# EAGLE schematic main (EAGLE 9.5.1)
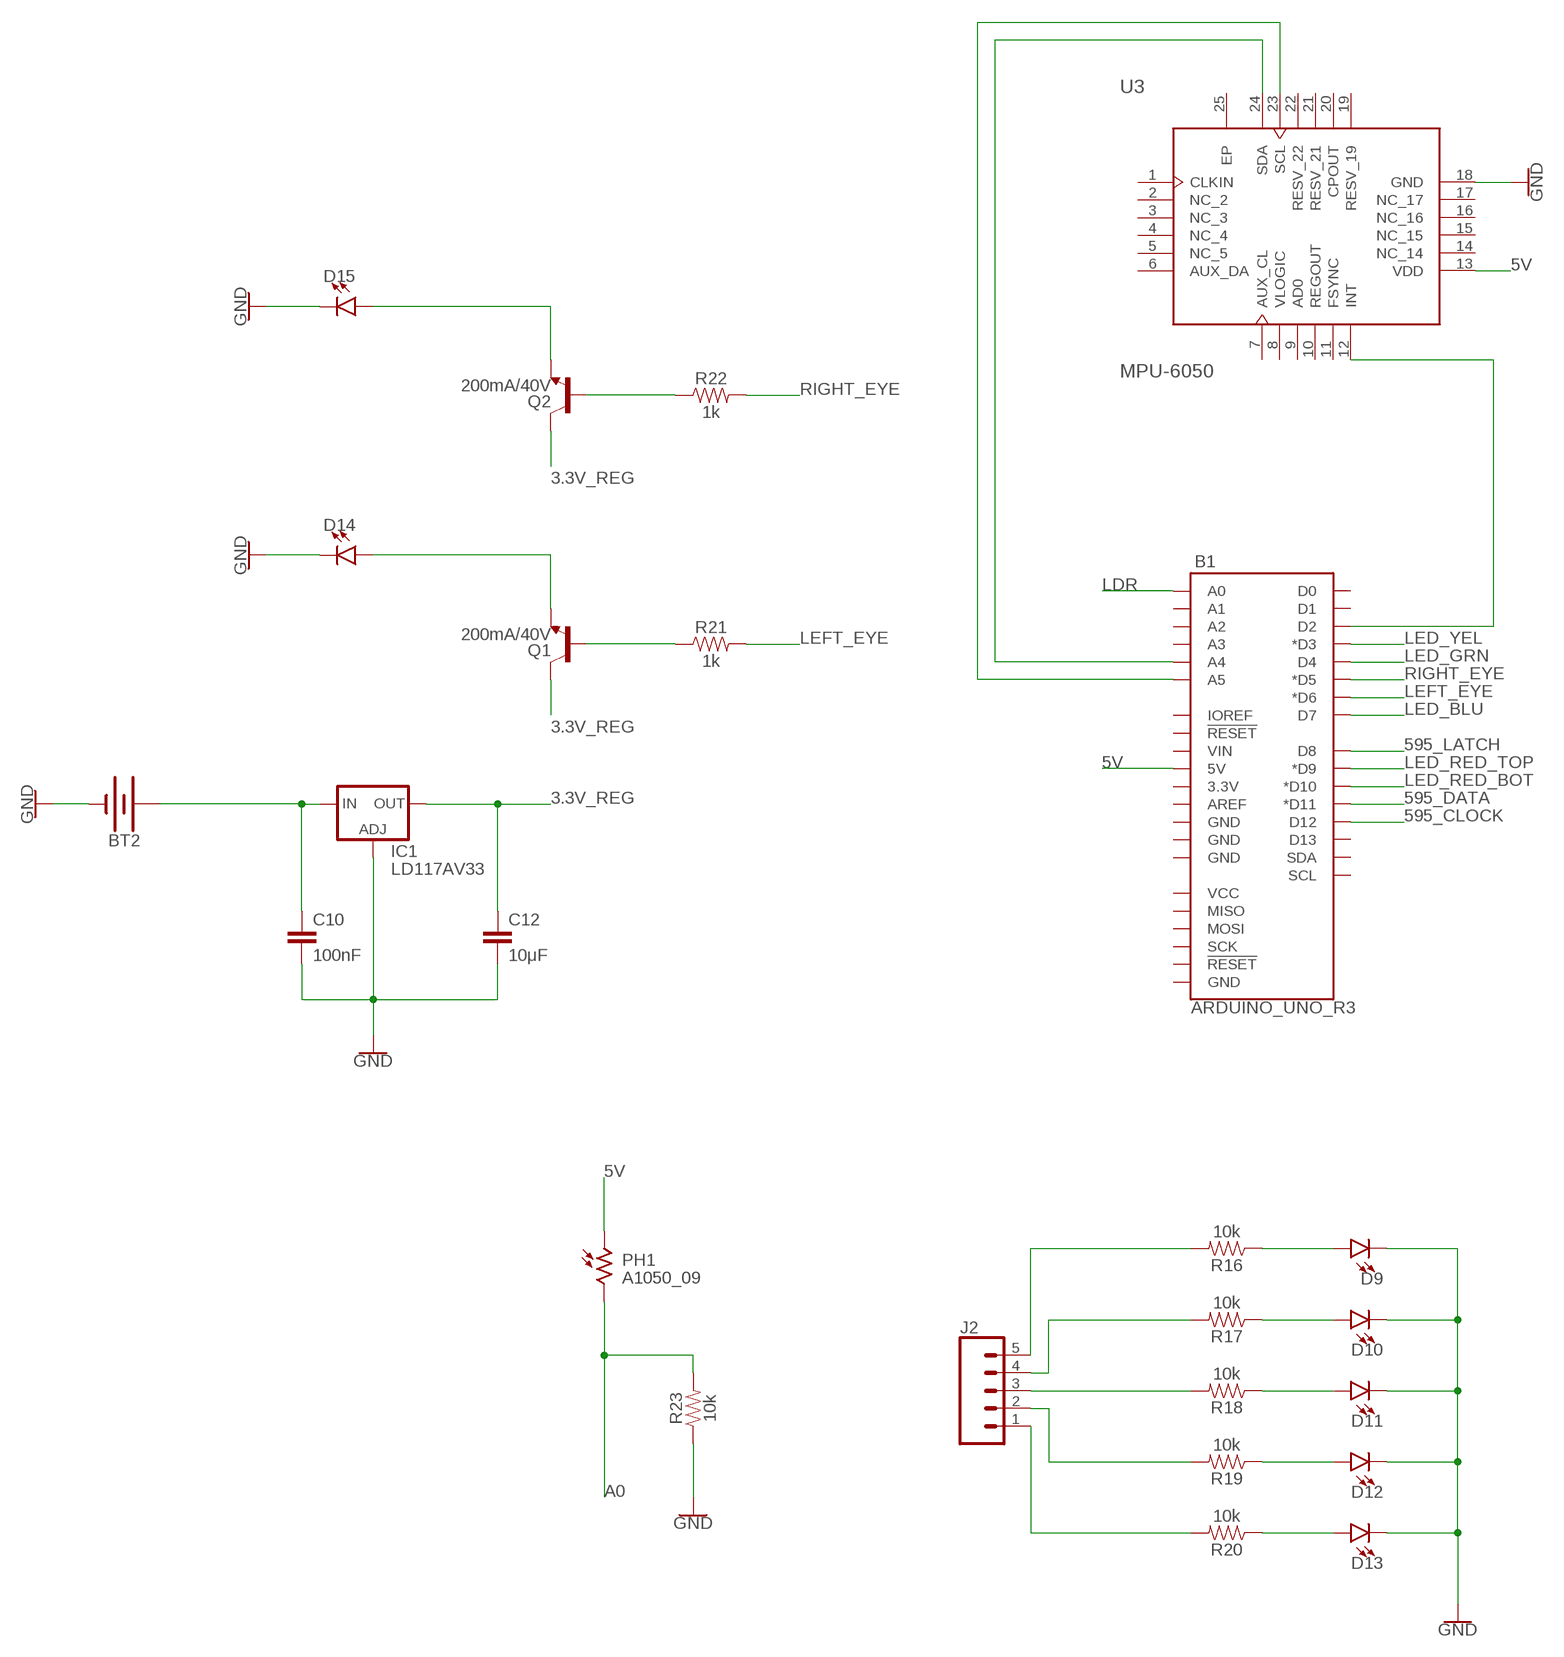
[diagram p0: schematic, sheet 1, part 1 of 2]
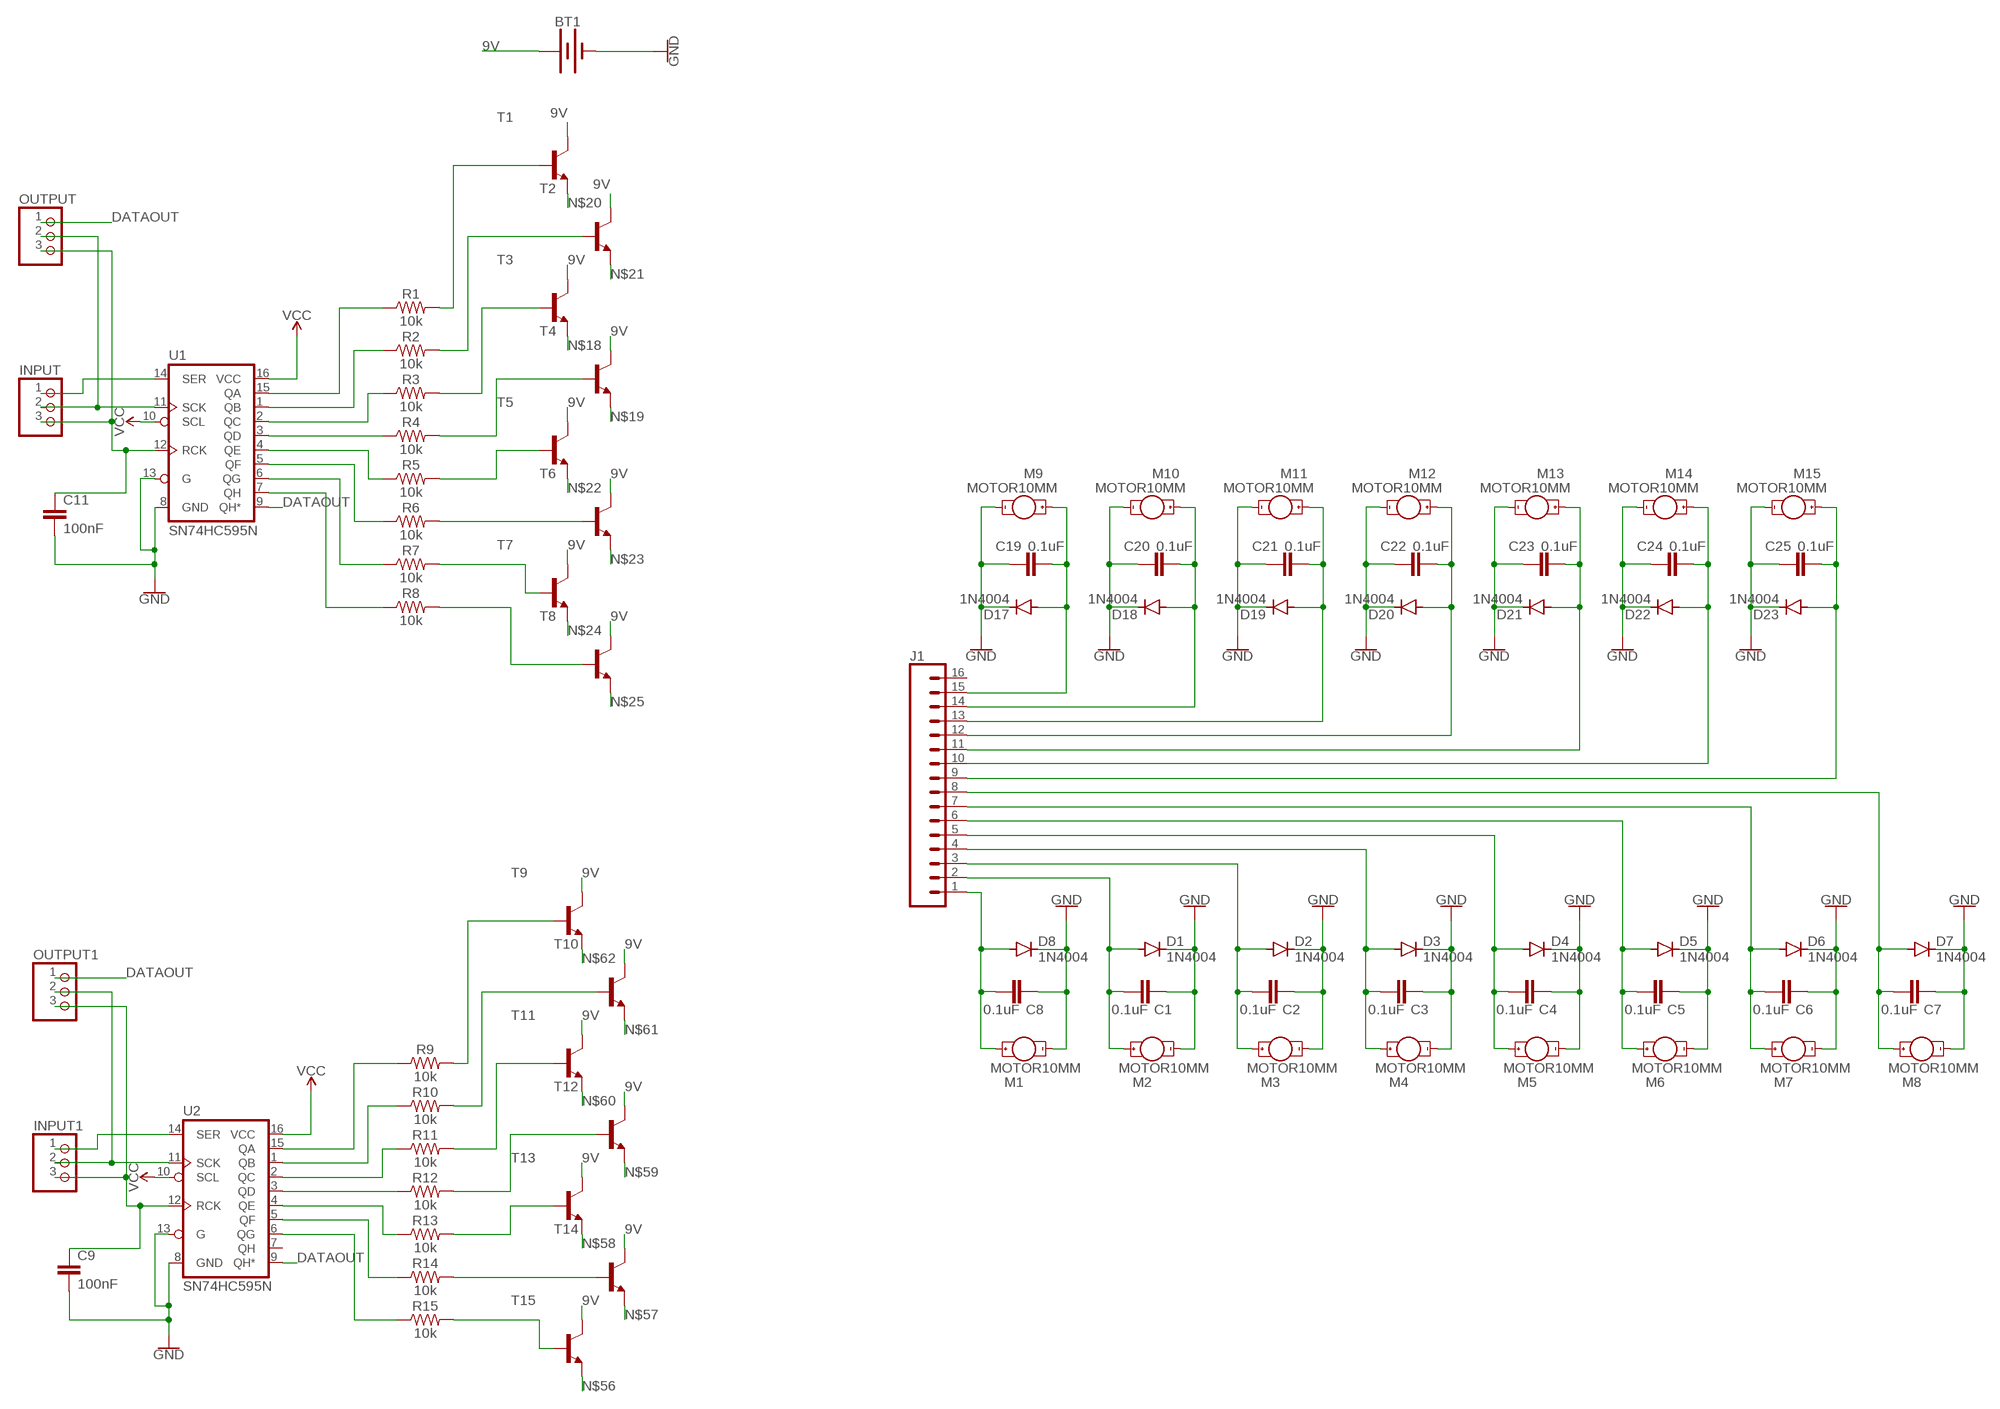
[diagram p1: schematic, sheet 1, part 2 of 2]

## Parts
B1  ARDUINO_UNO_R3  [ARDUINO_R3]
BT1  BATTERY-9V  [BATTCON_9V]
BT2  BATTERY-9V  [BATTCON_9V]
C1  0.1uF  0.1UF-KIT-EZ-50V-20%  [CAP-PTH-SMALL-KIT]
C2  0.1uF  0.1UF-KIT-EZ-50V-20%  [CAP-PTH-SMALL-KIT]
C3  0.1uF  0.1UF-KIT-EZ-50V-20%  [CAP-PTH-SMALL-KIT]
C4  0.1uF  0.1UF-KIT-EZ-50V-20%  [CAP-PTH-SMALL-KIT]
C5  0.1uF  0.1UF-KIT-EZ-50V-20%  [CAP-PTH-SMALL-KIT]
C6  0.1uF  0.1UF-KIT-EZ-50V-20%  [CAP-PTH-SMALL-KIT]
C7  0.1uF  0.1UF-KIT-EZ-50V-20%  [CAP-PTH-SMALL-KIT]
C8  0.1uF  0.1UF-KIT-EZ-50V-20%  [CAP-PTH-SMALL-KIT]
C9  100nF  10NF-PTH-10MM-10000V-1-%  [CAP-PTH-10MM]
C10  100nF  10NF-PTH-10MM-10000V-1-%  [CAP-PTH-10MM]
C11  100nF  10NF-PTH-10MM-10000V-1-%  [CAP-PTH-10MM]
C12  10μF  10NF-PTH-10MM-10000V-1-%  [CAP-PTH-10MM]
C19  0.1uF  0.1UF-KIT-EZ-50V-20%  [CAP-PTH-SMALL-KIT]
C20  0.1uF  0.1UF-KIT-EZ-50V-20%  [CAP-PTH-SMALL-KIT]
C21  0.1uF  0.1UF-KIT-EZ-50V-20%  [CAP-PTH-SMALL-KIT]
C22  0.1uF  0.1UF-KIT-EZ-50V-20%  [CAP-PTH-SMALL-KIT]
C23  0.1uF  0.1UF-KIT-EZ-50V-20%  [CAP-PTH-SMALL-KIT]
C24  0.1uF  0.1UF-KIT-EZ-50V-20%  [CAP-PTH-SMALL-KIT]
C25  0.1uF  0.1UF-KIT-EZ-50V-20%  [CAP-PTH-SMALL-KIT]
D1  1N4004  [DO41-10]
D2  1N4004  [DO41-10]
D3  1N4004  [DO41-10]
D4  1N4004  [DO41-10]
D5  1N4004  [DO41-10]
D6  1N4004  [DO41-10]
D7  1N4004  [DO41-10]
D8  1N4004  [DO41-10]
D9  LED5MM  [LED_5MM]
D10  LED5MM  [LED_5MM]
D11  LED5MM  [LED_5MM]
D12  LED5MM  [LED_5MM]
D13  LED5MM  [LED_5MM]
D14  LED10MM  [LED_10MM]
D15  LED10MM  [LED_10MM]
D17  1N4004  [DO41-10]
D18  1N4004  [DO41-10]
D19  1N4004  [DO41-10]
D20  1N4004  [DO41-10]
D21  1N4004  [DO41-10]
D22  1N4004  [DO41-10]
D23  1N4004  [DO41-10]
IC1  LD117AV33  [TO220L1]
INPUT  PINHD-1X3  [1X03]
INPUT1  PINHD-1X3  [1X03]
J1  CONN_16  [1X16]
J2  CONN_05  [1X05]
M1  MOTOR10MM  [VIBE-MOTOR-10MM]
M2  MOTOR10MM  [VIBE-MOTOR-10MM]
M3  MOTOR10MM  [VIBE-MOTOR-10MM]
M4  MOTOR10MM  [VIBE-MOTOR-10MM]
M5  MOTOR10MM  [VIBE-MOTOR-10MM]
M6  MOTOR10MM  [VIBE-MOTOR-10MM]
M7  MOTOR10MM  [VIBE-MOTOR-10MM]
M8  MOTOR10MM  [VIBE-MOTOR-10MM]
M9  MOTOR10MM  [VIBE-MOTOR-10MM]
M10  MOTOR10MM  [VIBE-MOTOR-10MM]
M11  MOTOR10MM  [VIBE-MOTOR-10MM]
M12  MOTOR10MM  [VIBE-MOTOR-10MM]
M13  MOTOR10MM  [VIBE-MOTOR-10MM]
M14  MOTOR10MM  [VIBE-MOTOR-10MM]
M15  MOTOR10MM  [VIBE-MOTOR-10MM]
OUTPUT  PINHD-1X3  [1X03]
OUTPUT1  PINHD-1X3  [1X03]
PH1  A1050_09  [T0-46-A10XX]
Q1  200mA/40V  TRANS_NPN-2N3904  [TO-92]
Q2  200mA/40V  TRANS_NPN-2N3904  [TO-92]
R1  10k  10KOHM-HORIZ-1/4W-1%  [AXIAL-0.3]
R2  10k  10KOHM-HORIZ-1/4W-1%  [AXIAL-0.3]
R3  10k  10KOHM-HORIZ-1/4W-1%  [AXIAL-0.3]
R4  10k  10KOHM-HORIZ-1/4W-1%  [AXIAL-0.3]
R5  10k  10KOHM-HORIZ-1/4W-1%  [AXIAL-0.3]
R6  10k  10KOHM-HORIZ-1/4W-1%  [AXIAL-0.3]
R7  10k  10KOHM-HORIZ-1/4W-1%  [AXIAL-0.3]
R8  10k  10KOHM-HORIZ-1/4W-1%  [AXIAL-0.3]
R9  10k  10KOHM-HORIZ-1/4W-1%  [AXIAL-0.3]
R10  10k  10KOHM-HORIZ-1/4W-1%  [AXIAL-0.3]
R11  10k  10KOHM-HORIZ-1/4W-1%  [AXIAL-0.3]
R12  10k  10KOHM-HORIZ-1/4W-1%  [AXIAL-0.3]
R13  10k  10KOHM-HORIZ-1/4W-1%  [AXIAL-0.3]
R14  10k  10KOHM-HORIZ-1/4W-1%  [AXIAL-0.3]
R15  10k  10KOHM-HORIZ-1/4W-1%  [AXIAL-0.3]
R16  10k  10KOHM-HORIZ-1/4W-1%  [AXIAL-0.3]
R17  10k  10KOHM-HORIZ-1/4W-1%  [AXIAL-0.3]
R18  10k  10KOHM-HORIZ-1/4W-1%  [AXIAL-0.3]
R19  10k  10KOHM-HORIZ-1/4W-1%  [AXIAL-0.3]
R20  10k  10KOHM-HORIZ-1/4W-1%  [AXIAL-0.3]
R21  1k  1KOHM-HORIZ-1/4W-1%  [AXIAL-0.3]
R22  1k  1KOHM-HORIZ-1/4W-1%  [AXIAL-0.3]
R23  10k  10KOHM-HORIZ-1/4W-1%  [AXIAL-0.3]
T1  2N3904-NPN-TO92-EBC  [TO92-EBC]
T2  2N3904-NPN-TO92-EBC  [TO92-EBC]
T3  2N3904-NPN-TO92-EBC  [TO92-EBC]
T4  2N3904-NPN-TO92-EBC  [TO92-EBC]
T5  2N3904-NPN-TO92-EBC  [TO92-EBC]
T6  2N3904-NPN-TO92-EBC  [TO92-EBC]
T7  2N3904-NPN-TO92-EBC  [TO92-EBC]
T8  2N3904-NPN-TO92-EBC  [TO92-EBC]
T9  2N3904-NPN-TO92-EBC  [TO92-EBC]
T10  2N3904-NPN-TO92-EBC  [TO92-EBC]
T11  2N3904-NPN-TO92-EBC  [TO92-EBC]
T12  2N3904-NPN-TO92-EBC  [TO92-EBC]
T13  2N3904-NPN-TO92-EBC  [TO92-EBC]
T14  2N3904-NPN-TO92-EBC  [TO92-EBC]
T15  2N3904-NPN-TO92-EBC  [TO92-EBC]
U1  SN74HC595N  74HC595N  [DIP16]
U2  SN74HC595N  74HC595N  [DIP16]
U3  MPU-6050  [24-VFQFN]

## Nets
3.3V_REG: C12.1 IC1.2(OUT) Q1.3(C) Q2.3(C)
5V: B1.5V PH1.1 U3.13(VDD)
9V: BT1.+ T1.C T2.C T3.C T4.C T5.C T6.C T7.C T8.C T9.C T10.C T11.C T12.C T13.C T14.C T15.C
595_CLOCK: B1.D12
595_DATA: B1.D11(*D11)
595_LATCH: B1.D8
A0: PH1.2 R23.P$2
DATAOUT: OUTPUT1.1 OUTPUT.1 U1.9(QH*) U2.9(QH*)
GND: BT1.- BT2.- C1.1 C2.1 C3.1 C4.1 C5.1 C6.1 C7.1 C8.1 C9.2 C10.2 C11.2 C12.2 C19.1 C20.1 C21.1 C22.1 C23.1 C24.1 C25.1 D1.C D2.C D3.C D4.C D5.C D6.C D7.C D8.C D9.K(C) D10.K(C) D11.K(C) D12.K(C) D13.K(C) D14.C D15.C D17.C D18.C D19.C D20.C D21.C D22.C D23.C IC1.1(ADJ) M1.- M2.- M3.- M4.- M5.- M6.- M7.- M8.- M9.- M10.- M11.- M12.- M13.- M14.- M15.- R23.P$1 U1.8(GND) U1.13(G) U2.8(GND) U2.13(G) U3.18(GND)
LDR: B1.A0
LED_BLU: B1.D7
LED_GRN: B1.D4
LED_RED_BOT: B1.D10(*D10)
LED_RED_TOP: B1.D9(*D9)
LED_YEL: B1.D3(*D3)
LEFT_EYE: B1.D6(*D6) R21.P$2
N$1: R12.P$1 U2.3(QD)
N$2: R4.P$1 U1.3(QD)
N$3: R5.P$1 U1.4(QE)
N$4: R6.P$1 U1.5(QF)
N$5: R7.P$1 U1.6(QG)
N$6: R8.P$1 U1.7(QH)
N$7: R3.P$1 U1.2(QC)
N$8: R2.P$1 U1.1(QB)
N$9: R1.P$1 U1.15(QA)
N$10: R1.P$2 T1.B
N$11: R2.P$2 T2.B
N$12: R3.P$2 T3.B
N$13: R4.P$2 T4.B
N$14: R5.P$2 T5.B
N$15: R6.P$2 T6.B
N$16: R7.P$2 T7.B
N$17: R8.P$2 T8.B
N$18: C2.2 D2.A J1.3 M3.+ T3.E
N$19: C3.2 D3.A J1.4 M4.+ T4.E
N$20: C8.2 D8.A J1.1 M1.+ T1.E
N$21: C1.2 D1.A J1.2 M2.+ T2.E
N$22: C4.2 D4.A J1.5 M5.+ T5.E
N$23: C5.2 D5.A J1.6 M6.+ T6.E
N$24: C6.2 D6.A J1.7 M7.+ T7.E
N$25: C7.2 D7.A J1.8 M8.+ T8.E
N$26: R13.P$1 U2.4(QE)
N$27: R14.P$1 U2.5(QF)
N$28: INPUT.1 U1.14(SER)
N$29: C11.1 INPUT.3 OUTPUT.3 U1.12(RCK)
N$30: INPUT.2 OUTPUT.2 U1.11(SCK)
N$31: R15.P$1 U2.6(QG)
N$32: J2.5 R16.P$2
N$33: R11.P$1 U2.2(QC)
N$34: R10.P$1 U2.1(QB)
N$35: R9.P$1 U2.15(QA)
N$36: R9.P$2 T9.B
N$37: R10.P$2 T10.B
N$38: R11.P$2 T11.B
N$39: R12.P$2 T12.B
N$40: R13.P$2 T13.B
N$41: R14.P$2 T14.B
N$42: R15.P$2 T15.B
N$43: D9.A R16.P$1
N$44: INPUT1.1 U2.14(SER)
N$45: C9.1 INPUT1.3 OUTPUT1.3 U2.12(RCK)
N$46: INPUT1.2 OUTPUT1.2 U2.11(SCK)
N$47: BT2.+ C10.1 IC1.3(IN)
N$48: J2.4 R17.P$2
N$49: D10.A R17.P$1
N$50: J2.3 R18.P$2
N$51: D11.A R18.P$1
N$52: J2.2 R19.P$2
N$53: J2.1 R20.P$2
N$54: D13.A R20.P$1
N$55: D12.A R19.P$1
N$56: C19.2 D17.A J1.15 M9.+ T15.E
N$57: C20.2 D18.A J1.14 M10.+ T14.E
N$58: C21.2 D19.A J1.13 M11.+ T13.E
N$59: C22.2 D20.A J1.12 M12.+ T12.E
N$60: C23.2 D21.A J1.11 M13.+ T11.E
N$61: C24.2 D22.A J1.10 M14.+ T10.E
N$62: C25.2 D23.A J1.9 M15.+ T9.E
N$63: Q1.2(B) R21.P$1
N$64: B1.D2 U3.12(INT)
N$65: D14.A Q1.1(E)
N$66: B1.A4 U3.24(SDA)
N$67: Q2.2(B) R22.P$1
N$68: B1.A5 U3.23(SCL)
N$69: D15.A Q2.1(E)
RIGHT_EYE: B1.D5(*D5) R22.P$2
VCC: U1.10(SCL) U1.16(VCC) U2.10(SCL) U2.16(VCC)
Unconnected: B1.3.3V B1.A1 B1.A2 B1.A3 B1.AREF B1.D0 B1.D1 B1.D13 B1.GND@1(GND) B1.GND@2(GND) B1.GND@3(GND) B1.GND@4(GND) B1.IOREF B1.MISO B1.MOSI B1.RESET@1(!RESET!) B1.RESET@2(!RESET!) B1.SCK B1.SCL B1.SDA B1.VCC B1.VIN J1.16 U2.7(QH) U3.1(CLKIN) U3.2(NC_2) U3.3(NC_3) U3.4(NC_4) U3.5(NC_5) U3.6(AUX_DA) U3.7(AUX_CL) U3.9(AD0) U3.10(REGOUT) U3.11(FSYNC) U3.14(NC_14) U3.15(NC_15) U3.16(NC_16) U3.17(NC_17) U3.19(RESV_19) U3.20(CPOUT) U3.21(RESV_21) U3.22(RESV_22)

## Power pins joined to a net without a drawn wire
EP: U3.25(EP)
VLOGIC: U3.8(VLOGIC)

## Library data of the parts
B1 = SparkFun-Boards:ARDUINO_UNO_R3: Arduino R3 Footprint with SPI header Arduino Uno R3 Compatible Footprint. Matches PCB size of the original board. SparkFun Products: SAMD21 Dev Breakout <https://www.sparkfun.com/products/13672> RedBoard <https://www.sparkfun.com/products/12757> R3 Stackable Headers <https://www.sparkfun.com/products/11417>
BT1 BT2 = SparkFun-Batteries:BATTERY: Battery - Single Cell A variety of battery chemistries, sizes, and footprints. Device List: 20MM_PTH - Coin Cell Battery Holder - 20mm (PTH) <https://www.sparkfun.com/products/783> 6.8MM_PTH - Coin Cell Battery Holder - 6.8MM(SMD) <https://www.digikey.com/product-detail/en/seiko-instruments/MS621FE-FL11E/728-1057-ND/1889208?WT.srch=1&gclid=CNOQ5a6LzdQCFZS2wAodXCkE0g> 12MM_SMD - Coin Cell Battery Holder - 12mm (SMD) <https://www.sparkfun.com/products/10592> 12MM_PTH - Coin Cell Battery Holder - 12mm (PTH) <https://www.sparkfun.com/products/7948> 20MM_SMD - 20mm Coin Cell Battery Holder (SMD) (2 legs) Used on the Big Time Watch Kit <https://www.sparkfun.com/products/11734> 20MM_SMD_4LEGS - Coin Cell Battery Holder - 20mm (SMD) <https://www.sparkfun.com/products/11892> 20MM_SMD_4LEGS_OVERPASTE - Coin Cell Battery Holder - 20mm (SMD) <https://www.sparkfun.com/products/11892> (Over-paste on the legs) 24.5MM_PTH - Coin Cell Battery Holder - 24.5mm (PTH) <https://www.sparkfun.com/products/8863> 9V - 9V Battery Holder - PC Mount Used on the SparkFun SparkPunk Sound Kit <https://www.sparkfun.com/products/11177> and SparkFun SparkPunk Sequencer Kit <https://www.sparkfun.com/products/12707> 18650 - Battery Holder - 18650 (PTH) <https://www.sparkfun.com/products/13113> AA - Battery Holder - 1xAA (PTH) <https://www.sparkfun.com/products/7949> AAA - Battery Holder - 1xAAA (PTH) <https://www.sparkfun.com/products/12718> AA_KIT - Battery Holder - 1xAA (PTH) <https://www.sparkfun.com/products/7949> Special kit package - pads only have exposed copper on one side of the board. AAA_KIT - Battery Holder - 1xAAA (PTH) <https://www.sparkfun.com/products/12718> Special kit package - pads only have exposed copper on one side of the board.; PROD_ID: BATT-10855
C1-C8 C19-C25 = SparkFun-Capacitors:0.1UF: 0.1µF ceramic capacitors A capacitor is a passive two-terminal electrical component used to store electrical energy temporarily in an electric field.; PROD_ID: CAP-08370
C9-C12 = SparkFun-Capacitors:10NF: 0.01uF/10nF/10,000pF ceramic capacitors A capacitor is a passive two-terminal electrical component used to store electrical energy temporarily in an electric field. CAP-09321; PROD_ID: CAP-09321; VALUE: 10nF
D1-D8 D17-D23 = diode:1N4004: DIODE general purpose rectifier, 1 A
D9-D15 = SparkFun-LED:LED: LED (Generic) Standard schematic elements and footprints for 5mm, 3mm, 1206, and 0603 sized LEDs. Generic LEDs with no color specified.
IC1 = v-reg:LD117A?*: Low drop fixed and adjustable positive voltage regulators 1 A Source: http://www.st.com/stonline/products/literature/ds/7194/ld1117axx.pdf
INPUT INPUT1 OUTPUT OUTPUT1 = pinhead:PINHD-1X3: PIN HEADER
J1 = SparkFun-Connectors:CONN_16: Multi connection point. Often used as Generic Header-pin footprint for 0.1 inch spaced/style header connections On any of the 0.1 inch spaced packages, you can populate with these: Break Away Headers - Straight <https://www.sparkfun.com/products/116> (PRT-00116) Break Away Male Headers - Right Angle <https://www.sparkfun.com/products/553> (PRT-00553) Female Headers <https://www.sparkfun.com/products/115> (PRT-00115) Break Away Headers - Machine Pin <https://www.sparkfun.com/products/117> (PRT-00117) Break Away Female Headers - Swiss Machine Pin <https://www.sparkfun.com/products/743> (PRT-00743) For SCREWTERMINALS and SPRING TERMINALS visit here: Screw Terimnals on SparkFun.com <https://www.sparkfun.com/search/results?term=Screw+Terminals> (5mm/3.5mm/2.54mm spacing) This device is also useful as a general connection point to wire up your design to another part of your project. Our various solder wires solder well into these plated through hole pads. Hook-Up Wire - Assortment (Stranded, 22 AWG) <https://www.sparkfun.com/products/11375> (PRT-11375) Hook-Up Wire - Assortment (Solid Core, 22 AWG) <https://www.sparkfun.com/products/11367> (PRT-11367) View the entire wire category on our website here <https://www.sparkfun.com/categories/141> Special notes: Molex polarized connector foot print use with SKU : PRT-08231 with associated crimp pins and housings. 1MM SMD Version SKU: PRT-10208 NOTES ON THE VARIANTS LOCK and LOCK_LONGPADS... This footprint was designed to help hold the alignment of a through-hole component (i.e. 6-pin header) while soldering it into place. You may notice that each hole has been shifted either up or down by 0.005 of an inch from it's more standard position (which is a perfectly straight line). This slight alteration caused the pins (the squares in the middle) to touch the edges of the holes. Because they are alternating, it causes a "brace" to hold the component in place. 0.005 has proven to be the perfect amount of "off-center" position when using our standard breakaway headers. Although looks a little odd when you look at the bare footprint, once you have a header in there, the alteration is very hard to notice. Also,if you push a header all the way into place, it is covered up entirely on the bottom side.
J2 = SparkFun-Connectors:CONN_05: Multi connection point. Often used as Generic Header-pin footprint for 0.1 inch spaced/style header connections On any of the 0.1 inch spaced packages, you can populate with these: Break Away Headers - Straight <https://www.sparkfun.com/products/116> (PRT-00116) Break Away Male Headers - Right Angle <https://www.sparkfun.com/products/553> (PRT-00553) Female Headers <https://www.sparkfun.com/products/115> (PRT-00115) Break Away Headers - Machine Pin <https://www.sparkfun.com/products/117> (PRT-00117) Break Away Female Headers - Swiss Machine Pin <https://www.sparkfun.com/products/743> (PRT-00743) For SCREWTERMINALS and SPRING TERMINALS visit here: Screw Terimnals on SparkFun.com <https://www.sparkfun.com/search/results?term=Screw+Terminals> (5mm/3.5mm/2.54mm spacing) This device is also useful as a general connection point to wire up your design to another part of your project. Our various solder wires solder well into these plated through hole pads. Hook-Up Wire - Assortment (Stranded, 22 AWG) <https://www.sparkfun.com/products/11375> (PRT-11375) Hook-Up Wire - Assortment (Solid Core, 22 AWG) <https://www.sparkfun.com/products/11367> (PRT-11367) View the entire wire category on our website here <https://www.sparkfun.com/categories/141> Special notes: Molex polarized connector foot print use with SKU : PRT-08231 with associated crimp pins and housings. 1MM SMD Version SKU: PRT-10208
M1-M15 = SparkFun-Electromechanical:MOTOR: Motor (Single-Phase) Two-terminal, single-phase motors. SparkFun Products Vibration Motor <https://www.sparkfun.com/products/8449> (ROB-08449) Physical dimension and wire connections for this powerful vibration motor. Motor has a self adhesive backing.; PROD_ID: COMP-08572; SF_SKU: ROB-08449
PH1 = photo-elements:A10: Sensor Robust Light Sensing Applications Outdoor Light Sensing Application Source: http://optoelectronics.perkinelmer.com/content/Datasheets/DTS_PhotocellsA1050.pdf
Q1 Q2 = SparkFun-DiscreteSemi:TRANS_NPN: NPN transistor Current controlled devices typically used to amplify current or used as a switch. BC547 - COM-08928 <http://www.sparkfun.com/products/8928> (TO-92 45V 100mA) (1.Collector 2.Base 3.Emitter) 2N3904 - COM-00521 <http://www.sparkfun.com/products/521> (TO-92 40V 200mA) (1.Emitter 2.Base 3.Collector) P2N2222A - COM-12852 <http://www.sparkfun.com/products/12852> (TO-92 40V 600mA) (1.Collector 2.Base 3.Emitter); PROD_ID: TRANS-08447
R1-R20 R23 = SparkFun-Resistors:10KOHM: 10kΩ resistor A resistor is a passive two-terminal electrical component that implements electrical resistance as a circuit element. Resistors act to reduce current flow, and, at the same time, act to lower voltage levels within circuits. - Wikipedia; PROD_ID: RES-12183
R21 R22 = SparkFun-Resistors:1KOHM: 1kΩ resistor A resistor is a passive two-terminal electrical component that implements electrical resistance as a circuit element. Resistors act to reduce current flow, and, at the same time, act to lower voltage levels within circuits. - Wikipedia; PROD_ID: RES-12182
T1-T15 = transistor-neu-to92:*-NPN-: NPN Transistror
U1 U2 = SparkFun-IC-Logic:74*595: 8-Bit Shift Register (Serial to Parallel) Datasheet <http://cdn.sparkfun.com/datasheets/BreakoutBoards/MM74HC595.pdf> SparkFun Products SparkFun Shift Register Breakout - 74HC595 <https://www.sparkfun.com/products/10680> (BOB-10680); PROD_ID: IC-13123
U3 = Sensor:MPU-6050: IMU ACCEL/GYRO 3-AXIS I2C 24QFN Manufacturer's datasheet <https://store.invensense.com/datasheets/invensense/MPU-6050_DataSheet_V3%204.pdf>; CREATED_BY: PCBLayout.com; DIGIKEY_PART_NUMBER: 1428-1007-1-ND; MANUFACTURER: TDK InvenSense; MPN: MPU-6050; PACKAGE: 24-VFQFN